# Altium schematic sheet FPGA_Config.SchDoc: SVPXFMC Carrier 3U
size 420 x 297 mm; CheckedBy: \; Author: G.Kasprowicz; CompanyName: ISE; DrawnBy: T.Przywozki; Organization: WUT ISE; Address1: Warsaw University of Technology; Address2: Nowowiejska 15/19 00-665 Warsaw; Revision: 1.0.; SheetNumber: 7; SheetTotal: 20; Project: SVPXFMC Carrier 3U; ModifiedBy: -; CheckedDate: -; Title2: FPGA Config; DivGrp: ISE; Designer: G. Kasprowicz
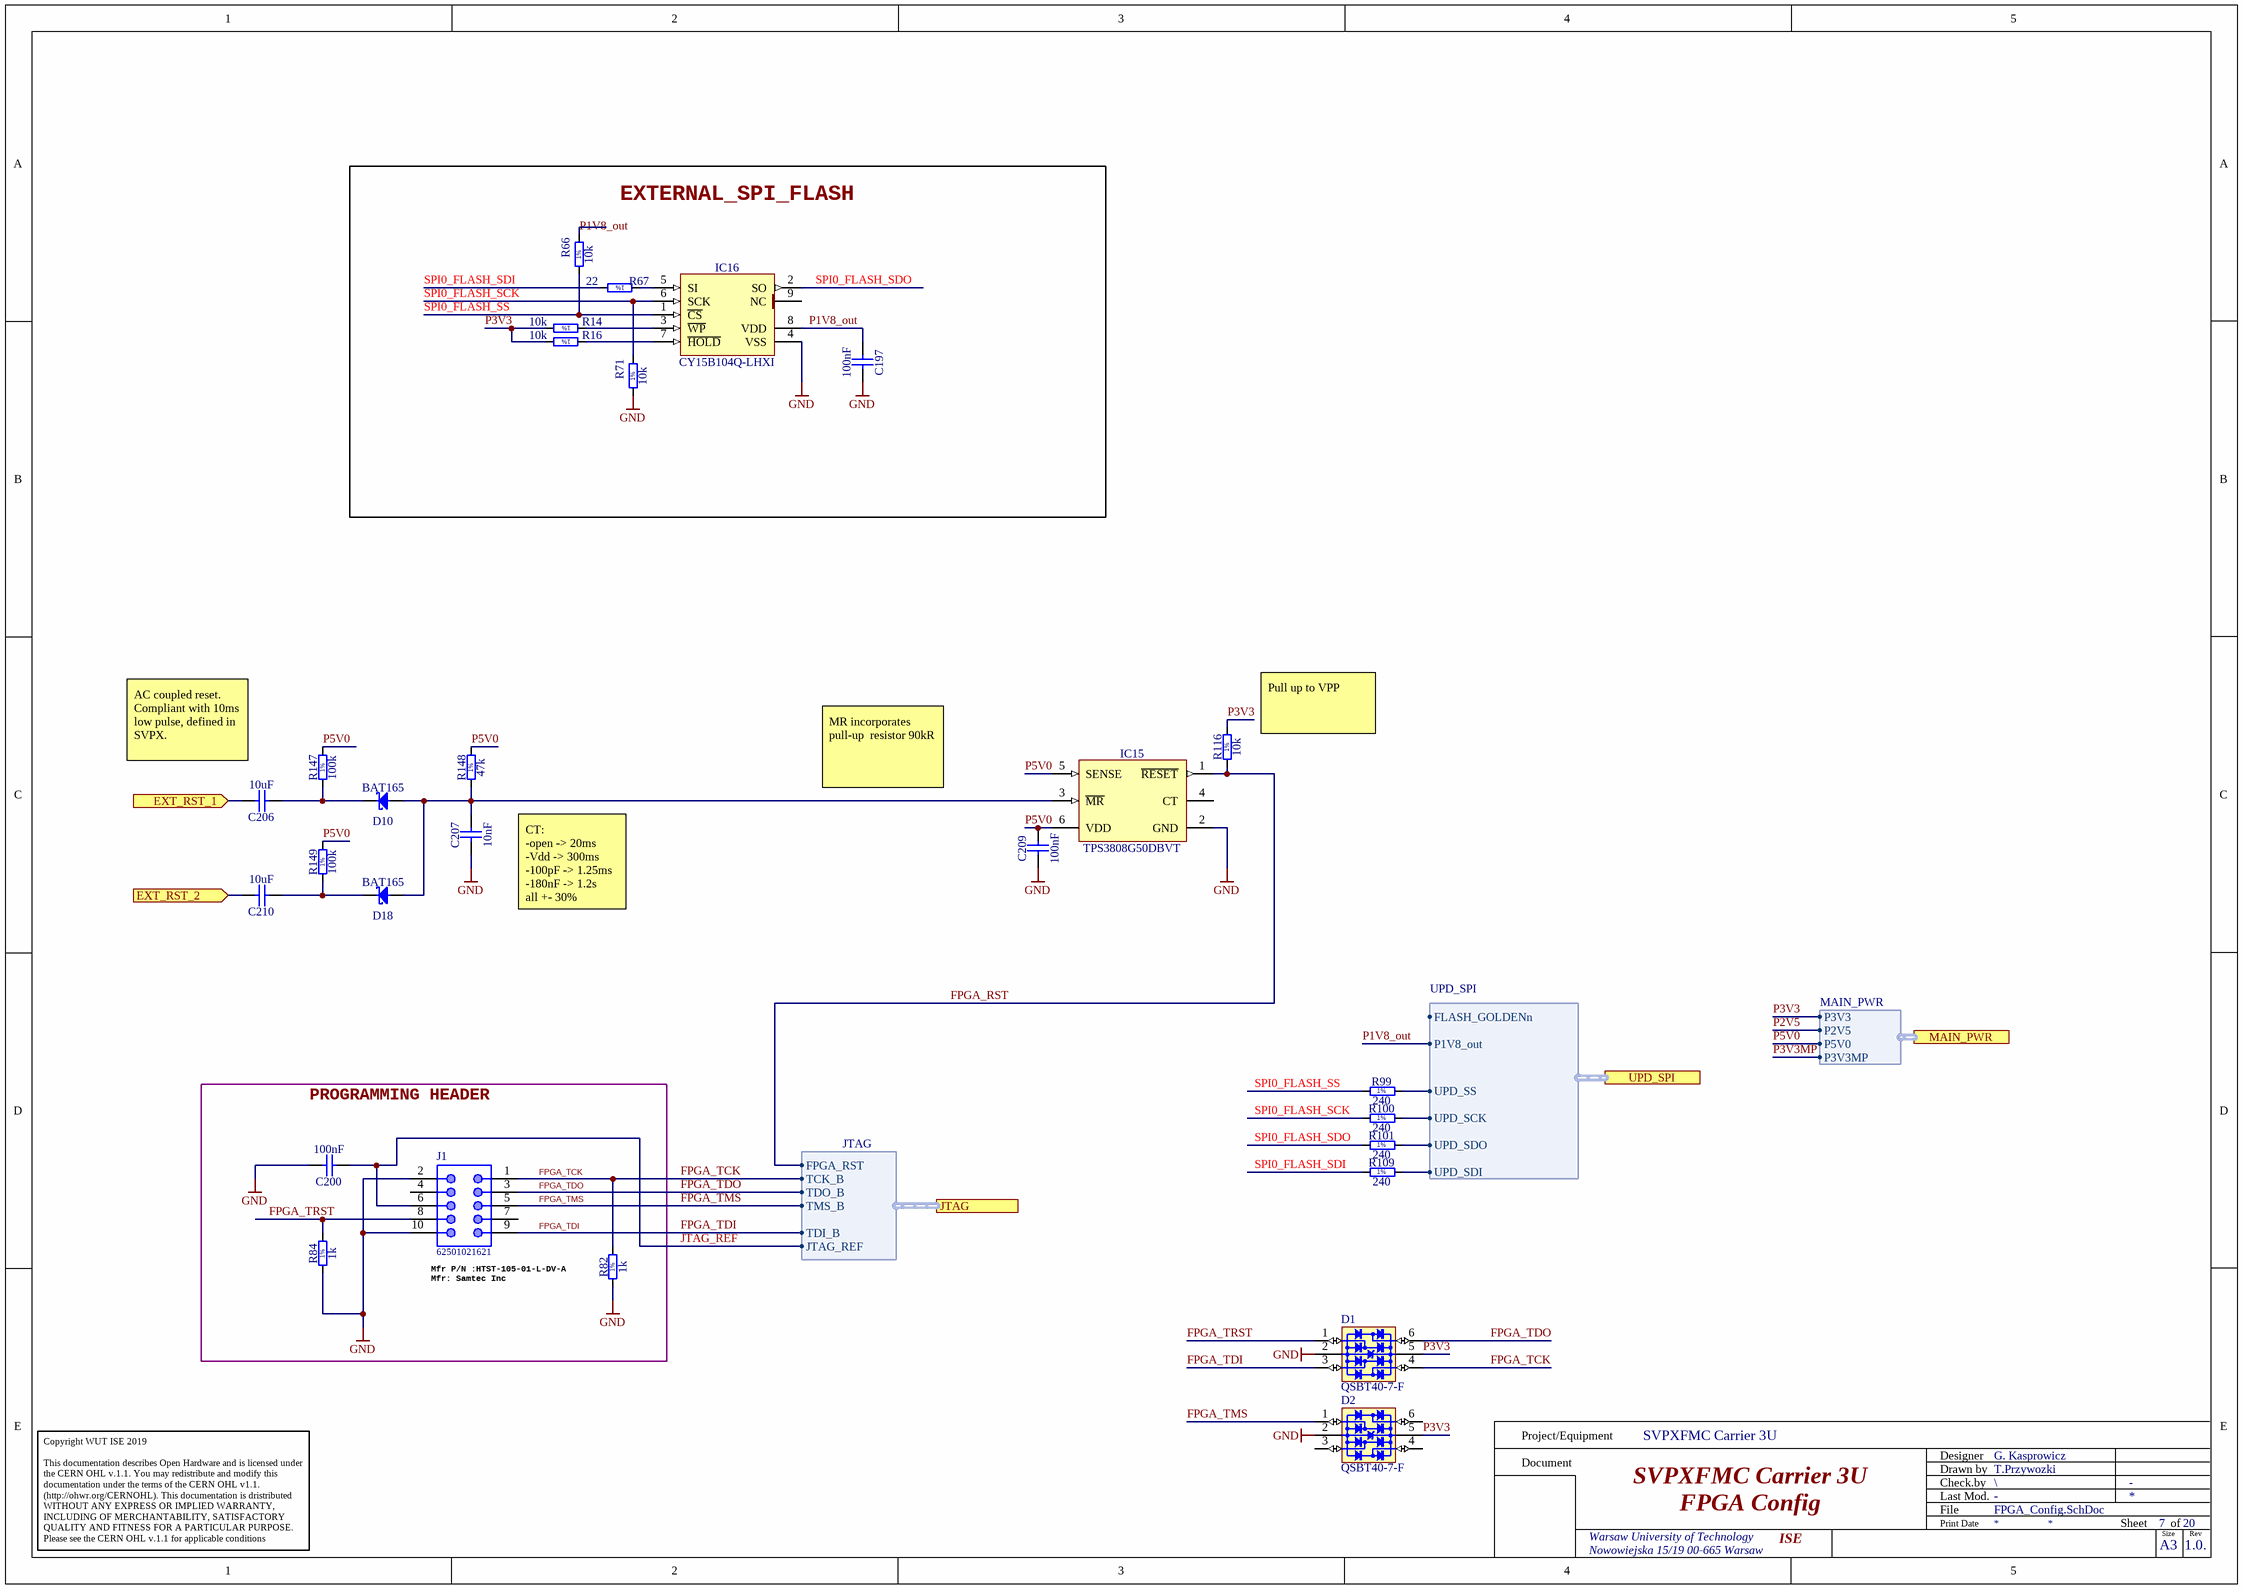
[diagram p0: FPGA_Config.SchDoc]

## Parts
C197  100nF  [CAPC0603X33N]
C200  100nF  [CAPC0603X33N]
C206  10uF  [CAPC1608X80N]
C207  10nF  [CAPC1005X55N]
C209  100nF  [CAPC1005X55N]
C210  10uF  [CAPC1608X80N]
D1  QSBT40-7-F  [SOT65P210X110-6N]
D2  QSBT40-7-F  [SOT65P210X110-6N]
D10  BAT165  [SOD2512X110N]
D18  BAT165  [SOD2512X110N]
IC15  TPS3808G50DBVT  [SOT95P280X145-6N]
IC16  CY15B104Q-LHXI  [SON127P600X500X80-9N-R240X410]
J1  62501021621  [62501021621]
R14  10k  [RESC1005X40N]
R16  10k  [RESC1005X40N]
R66  10k  [RESC1005X40N]
R67  22  [RESC1005X40N]
R71  10k  [RESC1005X40N]
R82  1k  [RESC1005X40N]
R84  1k  [RESC1005X40N]
R99  240  [RESC1005X40N]
R100  240  [RESC1005X40N]
R101  240  [RESC1005X40N]
R109  240  [RESC1005X40N]
R116  10k  [RESC1005X40N]
R147  100k  [RESC1005X40N]
R148  47k  [RESC1005X40N]
R149  100k  [RESC1005X40N]

## Blocks framed on the sheet
EXTERNAL_SPI_FLASH: C197 IC16 R14 R16 R66 R67 R71
PROGRAMMING HEADER: C200 J1 R82 R84

## Ports
EXT_RST_1 (in), EXT_RST_2 (in), JTAG (harness JTAG), MAIN_PWR (harness MAIN_PWR), UPD_SPI (harness UPD_SPI)

## Harnesses
UPD_SPI: UPD_SS, UPD_SCK, UPD_SDO, UPD_SDI, FLASH_GOLDENn, P1V8_out
MAIN_PWR: P3V3, P2V5, P5V0, P3V3MP
JTAG: JTAG_REF, TDO_B, TMS_B, TDI_B, TCK_B, FPGA_RST

## Nets
GND: C197.1 C200.2 C207.1 C209.1 D1.2(GND) D2.2(GND) IC15.2(GND) IC16.4(VSS) J1.2 J1.10 R71.1 R82.1 R84.1
EXT_RST_1: C206.2 ; port EXT_RST_1
EXT_RST_2: C210.2 ; port EXT_RST_2
FPGA_RST: IC15.1(~{RESET}) R116.1 ; port JTAG.FPGA_RST
FPGA_TCK: D1.4(I/O3) J1.1 R82.2 ; port JTAG.TCK_B
FPGA_TDI: D1.3(I/O2) J1.9 ; port JTAG.TDI_B
FPGA_TDO: D1.6(I/O4) J1.3 ; port JTAG.TDO_B
FPGA_TMS: D2.1(I/O1) J1.5 ; port JTAG.TMS_B
FPGA_TRST: D1.1(I/O1) J1.8 R84.2
JTAG_REF: C200.1 J1.6 ; port JTAG.JTAG_REF
P1V8_out: C197.2 IC16.8(VDD) R66.2 ; port UPD_SPI.P1V8_out
P2V5: port MAIN_PWR.P2V5
P3V3: D1.5(VBUS) D2.5(VBUS) R14.2 R16.2 R116.2 ; port MAIN_PWR.P3V3
P3V3MP: port MAIN_PWR.P3V3MP
P5V0: C209.2 IC15.5(SENSE) IC15.6(VDD) R147.2 R148.2 R149.2 ; port MAIN_PWR.P5V0
SPI0_FLASH_SCK: IC16.6(SCK) R71.2 R100.1
SPI0_FLASH_SDI: R67.2 R109.1
SPI0_FLASH_SDO: IC16.2(SO) R101.1
SPI0_FLASH_SS: IC16.1(~{CS}) R66.1 R99.1
NetC206_1: C206.1 D10.1(C) R147.1
NetC207_2: C207.2 D10.2(A) D18.2(A) IC15.3(~{MR}) R148.1
NetC210_1: C210.1 D18.1(C) R149.1
NetIC16_3: IC16.3(~{WP}) R14.1
NetIC16_5: IC16.5(SI) R67.1
NetIC16_7: IC16.7(~{HOLD}) R16.1
NetR99_2: R99.2 ; port UPD_SPI.UPD_SS
NetR100_2: R100.2 ; port UPD_SPI.UPD_SCK
NetR101_2: R101.2 ; port UPD_SPI.UPD_SDO
NetR109_2: R109.2 ; port UPD_SPI.UPD_SDI

Not connected (* = marked no-connect by the designer): D2 3(I/O2) 4(I/O3) 6(I/O4); IC15 4(CT); IC16 9(NC); J1 4 7

## Notes on the sheet
- (near R116) Pull up to VPP
- (near C206) AC coupled reset. Compliant with 10ms low pulse, defined in SVPX.
- MR incorporates pull-up  resistor 90kR
- CT:
  -open -> 20ms
  -Vdd -> 300ms
  -100pF -> 1.25ms
  -180nF -> 1.2s
  all +- 30%
- (near R82) Mfr P/N :HTST-105-01-L-DV-A
  Mfr: Samtec Inc
- Project/Equipment
- Document
- Designer
- Drawn by
- Check.by
- File
- Last Mod.
- Print Date
- Sheet
- Size
- A3
- of
- Rev
- Copyright WUT ISE 2019
  This documentation describes Open Hardware and is licensed under the CERN OHL v.1.1. You may redistribute and modify this documentation under the terms of the CERN OHL v1.1.
  (http://ohwr.org/CERNOHL). This documentation is dristributed WITHOUT ANY EXPRESS OR IMPLIED WARRANTY, INCLUDING OF MERCHANTABILITY, SATISFACTORY QUALITY AND FITNESS FOR A PARTICULAR PURPOSE. Please see the CERN OHL v.1.1 for applicable conditions
- (in symbol R0402_1K_1%_0.0625W_100PPM) 1%
- (in symbol R0402_10K_1%_0.0625W_100PPM) 1%
- (in symbol R0402_22R_1%_0.0625W_100PPM) 1%
- (in symbol R0402_47K_1%_0.0625W_100PPM) 1%
- (in symbol R0402_100K_1%_0.0625W_100PPM) 1%
- (in symbol R0402_240R_1%_0.0625W_100PPM) 1%

## Library data of the parts
C197 C200 = CC0201_100NF_6.3V_10%_X5R: Non-polarised capacitor; Manufacturer: GENERIC; Part Description: SMD Multilayer Chip Ceramic Capacitor; Manufacturer1 Part Number: 02016D104KAT2A; Voltage: 6.3V; TC: X5R; Tolerance: ±10%; Part Number: CC0201_100NF_6.3V_10%_X5R; Component Kind: Standard; Component Type: Standard; Pin Count: 2; Value: 100nF; Status: Not Recommended; Manufacturer Part Number: CC0201_100NF_6.3V_10%_X5R; Case: 0201; Mounted: Yes; Socket: No; SMD: Yes; Sense: No; Manufacturer1 Example: AVX; Manufacturer1 ComponentHeight: 0.33mm; HelpURL: \\cern.ch\dfs\Applications\Altium\Datasheets\CC0201_X5R_AVX.pdf; Author: CERN DEM JLC; CreateDate: 03/12/2007; LatestRevisionDate: 03/12/2007
C206 C210 = CC0603_10UF_16V_20%_X5R: Non-polarised capacitor; Part Description: SMD Multilayer Chip Ceramic Capacitor; Manufacturer: GENERIC; Manufacturer1 Part Number: GRM188R61C106MA73D; Voltage: 16V; TC: X5R; Tolerance: ±20%; Part Number: CC0603_10UF_16V_20%_X5R; Component Kind: Standard; Component Type: Standard; Pin Count: 2; Value: 10uF; Status: None; Manufacturer Part Number: CC0603_10UF_16V_20%_X5R; Case: 0603; Mounted: Yes; Socket: No; SMD: Yes; Sense: No; Manufacturer1 Example: MURATA; Manufacturer1 ComponentHeight: 0.8mm; HelpURL: \\cern.ch\dfs\Applications\Altium\Datasheets\CC0603_X5R_MURATA_GRM.pdf; Author: CERN DEM MR; CreateDate: 2016-03-02; LatestRevisionDate: 2016-03-02
C207 = CC0402_10NF_50V_10%_X7R: Non-polarised capacitor; Part Description: SMD Multilayer Chip Ceramic Capacitor; Manufacturer: GENERIC; Manufacturer1 Part Number: GRM155R71H103KA88D; Voltage: 50V; TC: X7R; Tolerance: ±10%; Part Number: CC0402_10NF_50V_10%_X7R; Component Kind: Standard; Component Type: Standard; Pin Count: 2; Value: 10nF; Status: None; Manufacturer Part Number: CC0402_10NF_50V_10%_X7R; Case: 0402; Mounted: Yes; Socket: No; SMD: Yes; Sense: No; Manufacturer1 Example: MURATA; Manufacturer1 ComponentHeight: 0.55mm; HelpURL: \\cern.ch\dfs\Applications\Altium\Datasheets\CC0402_X7R_MURATA_GRM.pdf; Author: CERN DEM MR; CreateDate: 08.01.2016; LatestRevisionDate: 08.01.2016
C209 = CC0402_100NF_25V_10%_X7R_YUDEN_TMK105B7104KVHF: Non-polarised capacitor; Part Description: SMD Multilayer Chip Ceramic Capacitor (High Dielectric Type) for Automotive / Industrial Applications; Manufacturer: TAIYO YUDEN; Voltage: 25V; TC: X7R; Tolerance: ±10%; Part Number: CC0402_100NF_25V_10%_X7R_YUDEN_TMK105B7104KVHF; Component Kind: Standard; Component Type: Standard; Pin Count: 2; Value: 100nF; Status: Not Recommended; Manufacturer Part Number: TMK105B7104KVHF; Case: 0402; Mounted: Yes; Socket: No; SMD: Yes; Sense: No; HelpURL: \\cern.ch\dfs\Applications\Altium\Datasheets\CC0402_TAIYO-YUDEN_TMK105B7104KVHF.pdf; Author: CERN DEM JLC; CreateDate: 10.05.2017; LatestRevisionDate: 10.05.2017; ComponentHeight: 0.55mm
D1 D2 = D_TVS_QSBT40-7-F: Bonding: No; PressFit: No; Case: *; Component Kind: Standard; Component Type: Standard; ComponentHeigth: *; CreateDate: 2018-01-01; Device: QSBT40-7-F; Footprint: SOT363; HelpURL: *; LatestRevisionDate: 2018-01-01; Manufacturer: *; Manufacturer Part Number: QSBT40-7-F; Mounted: Yes; PackageDescription: *; Part Description: *; Part Number: *; Pin Count: 6; Sense: No; SMD: Yes; Socket: No; Value: *
D10 D18 = BAT165: Schottky Diode; Part Description: Medium Power AF Schottky Diode; Manufacturer: INFINEON; Voltage: 40V; Power: 750mA; PressFit: No; Bonding: No; Part Number: BAT165; Component Kind: Standard; Component Type: Standard; Device: BAT165; PackageDescription: Small Outline Diode (SOD-323), 1.70mm W X 1.25mm L X 1.10mm H body,  IPC Medium Density; Manufacturer Part Number: BAT165; Pin Count: 2; Case: SOD323; Mounted: Yes; Socket: No; SMD: Yes; Sense: No; ComponentHeight: 1.1mm; HelpURL: \\cern.ch\dfs\Applications\Altium\Datasheets\BAT165.pdf; Author: CERN DEM JLC; CreateDate: 12.11.2014; LatestRevisionDate: 12.11.2014
IC15 = TPS3808G50DBVT: Low Quiescent Current, Programmable-Delay Supervisory Circuit; Part Description: 5V, Low Quiescent Current, Programmable-Delay Supervisory Circuit; Manufacturer: TEXAS INSTRUMENTS; PressFit: No; Bonding: No; Part Number: TPS3808G50DBVT; Component Kind: Standard; Component Type: Standard; Device: TPS3808G50DBVT; PackageDescription: SOT23, 6-Leads, Body 1.6x3.0mm, Pitch 0.95mm, IPC Medium Density; Manufacturer Part Number: TPS3808G50DBVT; Pin Count: 6; Case: SOT23-6; Mounted: Yes; Socket: No; SMD: Yes; Sense: No; ComponentHeight: 1.45mm; Author: CERN DEM JLC; HelpURL: \\cern.ch\dfs\Applications\Altium\Datasheets\TPS3808G50DBVT.pdf; CreateDate: 02.03.2015; LatestRevisionDate: 02.03.2015
IC16 = CY15B104Q-LHXI: 4Mb Serial 3V F-RAM Memory; Manufacturer: CYPRESS; PressFit: No; Bonding: No; Part Number: CY15B104Q-LHXI; Component Kind: Standard; Component Type: Standard; Device: CY15B104Q-LHXI; PackageDescription: SON, 1.27mm pitch, 8 pin, 6.00mm W X 5.00mm L X 0.80mm H body (w/thermal tab  2.40 X 4.10 mm), IPC Medium Density; Part Description: 4Mb Serial 3V F-RAM Memory; Manufacturer Part Number: CY15B104Q-LHXI; Pin Count: 9; Case: SON8; Mounted: Yes; Socket: No; SMD: Yes; Sense: No; ComponentHeight: 0.8mm; HelpURL: \\cern.ch\dfs\Applications\Altium\Datasheets\CY15B104Q-LHXI.pdf; Author: CERN DEM MR; CreateDate: 14.03.2017; LatestRevisionDate: 14.03.2017
J1 = 62501021621: Male Box Header WR-BHD with long lever, THT, Vertical, pitch 2.00 mm, 10 pins; Pin Number: 10; Pitch: 2.00 mm; Working Voltage: 250 VAC; Withstanding Voltage: 500 VAC; Contact Resistance: 20 mOhm; ComponentLink1Description: Manufacturer; ComponentLink1URL: http://www.we-online.de; ComponentLink2Description: Datasheet; ComponentLink2URL: https://katalog.we-online.de/em/datasheet/6250xx21621.pdf; Part Number: 62501021621; Published Date: August 2018; Publisher: Wurth Elektronik; Operating Temperature: -40 to 125 degC; Packaging: Tray; Gender: Male; Mounting Technology: THT; Orientation: Vertical
R14 R16 R66 R71 = R0402_10K_1%_0.0625W_100PPM: Resistor - 1%; Manufacturer: GENERIC; Part Description: General Purpose Thick Film Chip Resistor; Manufacturer1 Part Number: 232270671003L; TC: ±100ppm/°C; PressFit: No; Manufacturer Part Number: R0402_10K_1%_0.0625W_100PPM; Part Number: R0402_10K_1%_0.0625W_100PPM; Tolerance: ±1%; Value: 10k; Component Kind: Standard; Component Type: Standard; Pin Count: 2; Status: Not Recommended; Power: 0.0625W; Case: 0402; Mounted: Yes; Sense: No; Socket: No; SMD: Yes; Manufacturer1 Example: YAGEO PHYCOMP; Manufacturer1 ComponentHeight: 0.4mm; HelpURL: \\cern.ch\dfs\Applications\Altium\Datasheets\R0402_Phycomp_RC0402.pdf; Author: CERN DEM JLC; CreateDate: 03/12/2007; LatestRevisionDate: 17/10/2012
R67 = R0402_22R_1%_0.0625W_100PPM: Resistor - 1%; Manufacturer: GENERIC; Part Description: General Purpose Thick Film Chip Resistor; Manufacturer1 Part Number: 232270672209L; TC: ±100ppm/°C; PressFit: No; Part Number: R0402_22R_1%_0.0625W_100PPM; Component Kind: Standard; Component Type: Standard; Pin Count: 2; Value: 22; Status: Not Recommended; Power: 0.0625W; Tolerance: ±1%; Manufacturer Part Number: R0402_22R_1%_0.0625W_100PPM; Case: 0402; Mounted: Yes; Sense: No; Socket: No; SMD: Yes; Manufacturer1 Example: YAGEO PHYCOMP; Manufacturer1 ComponentHeight: 0.4mm; HelpURL: \\cern.ch\dfs\Applications\Altium\Datasheets\R0402_Phycomp_RC0402.pdf; Author: CERN DEM JLC; CreateDate: 03/12/2007; LatestRevisionDate: 17/10/2012
R82 R84 = R0402_1K_1%_0.0625W_100PPM: Resistor - 1%; Part Description: General Purpose Thick Film Chip Resistor; Manufacturer: GENERIC; Manufacturer1 Part Number: 232270671002L; TC: ±100ppm/°C; PressFit: No; Part Number: R0402_1K_1%_0.0625W_100PPM; Component Kind: Standard; Component Type: Standard; Pin Count: 2; Value: 1k; Status: Not Recommended; Power: 0.0625W; Tolerance: ±1%; Manufacturer Part Number: R0402_1K_1%_0.0625W_100PPM; Case: 0402; Mounted: Yes; Sense: No; Socket: No; SMD: Yes; Manufacturer1 Example: YAGEO PHYCOMP; Manufacturer1 ComponentHeight: 0.4mm; HelpURL: \\cern.ch\dfs\Applications\Altium\Datasheets\R0402_Phycomp_RC0402.pdf; Author: CERN DEM JLC; CreateDate: 03/12/2007; LatestRevisionDate: 17/10/2012
R99-R101 R109 = R0402_240R_1%_0.0625W_100PPM: Resistor - 1%; Part Description: General Purpose Thick Film Chip Resistor; Manufacturer: GENERIC; Manufacturer1 Part Number: 232270672401L; TC: ±100ppm/°C; PressFit: No; Part Number: R0402_240R_1%_0.0625W_100PPM; Component Kind: Standard; Component Type: Standard; Pin Count: 2; Value: 240; Status: Not Recommended; Power: 0.0625W; Tolerance: ±1%; Manufacturer Part Number: R0402_240R_1%_0.0625W_100PPM; Case: 0402; Mounted: Yes; Sense: No; Socket: No; SMD: Yes; Manufacturer1 Example: YAGEO PHYCOMP; Manufacturer1 ComponentHeight: 0.4mm; HelpURL: \\cern.ch\dfs\Applications\Altium\Datasheets\R0402_Phycomp_RC0402.pdf; Author: CERN DEM JLC; CreateDate: 03/12/2007; LatestRevisionDate: 17/10/2012
R116 = R0402_10K_1%_0.0625W_100PPM: Resistor - 1%; Part Description: General Purpose Thick Film Chip Resistor; Manufacturer: GENERIC; Manufacturer1 Part Number: 232270671003L; TC: ±100ppm/°C; PressFit: No; Part Number: R0402_10K_1%_0.0625W_100PPM; Component Kind: Standard; Component Type: Standard; Pin Count: 2; Value: 10k; Status: Not Recommended; Power: 0.0625W; Tolerance: ±1%; Manufacturer Part Number: R0402_10K_1%_0.0625W_100PPM; Case: 0402; Mounted: Yes; Sense: No; Socket: No; SMD: Yes; Manufacturer1 Example: YAGEO PHYCOMP; Manufacturer1 ComponentHeight: 0.4mm; HelpURL: \\cern.ch\dfs\Applications\Altium\Datasheets\R0402_Phycomp_RC0402.pdf; Author: CERN DEM JLC; CreateDate: 03.12.2007; LatestRevisionDate: 17.10.2012
R147 R149 = R0402_100K_1%_0.0625W_100PPM: Resistor - 1%; Part Description: General Purpose Thick Film Chip Resistor; Manufacturer: GENERIC; Manufacturer1 Part Number: 232270671004L; TC: ±100ppm/°C; PressFit: No; Part Number: R0402_100K_1%_0.0625W_100PPM; Component Kind: Standard; Component Type: Standard; Pin Count: 2; Value: 100k; Status: Not Recommended; Power: 0.0625W; Tolerance: ±1%; Manufacturer Part Number: R0402_100K_1%_0.0625W_100PPM; Case: 0402; Mounted: Yes; Sense: No; Socket: No; SMD: Yes; Manufacturer1 Example: YAGEO PHYCOMP; Manufacturer1 ComponentHeight: 0.4mm; HelpURL: \\cern.ch\dfs\Applications\Altium\Datasheets\R0402_Phycomp_RC0402.pdf; Author: CERN DEM JLC; CreateDate: 03.12.2007; LatestRevisionDate: 17.10.2012
R148 = R0402_47K_1%_0.0625W_100PPM: Resistor - 1%; Part Description: General Purpose Thick Film Chip Resistor; Manufacturer: GENERIC; Manufacturer1 Part Number: 232270675103L; TC: ±100ppm/°C; PressFit: No; Part Number: R0402_47K_1%_0.0625W_100PPM; Component Kind: Standard; Component Type: Standard; Pin Count: 2; Value: 47k; Status: Not Recommended; Power: 0.0625W; Tolerance: ±1%; Manufacturer Part Number: R0402_47K_1%_0.0625W_100PPM; Case: 0402; Mounted: Yes; Sense: No; Socket: No; SMD: Yes; Manufacturer1 Example: YAGEO PHYCOMP; Manufacturer1 ComponentHeight: 0.4mm; HelpURL: \\cern.ch\dfs\Applications\Altium\Datasheets\R0402_Phycomp_RC0402.pdf; Author: CERN DEM JLC; CreateDate: 03.12.2007; LatestRevisionDate: 17.10.2012